# EAGLE design BpodFSM_r2_5_v6 (EAGLE 9.6.2)
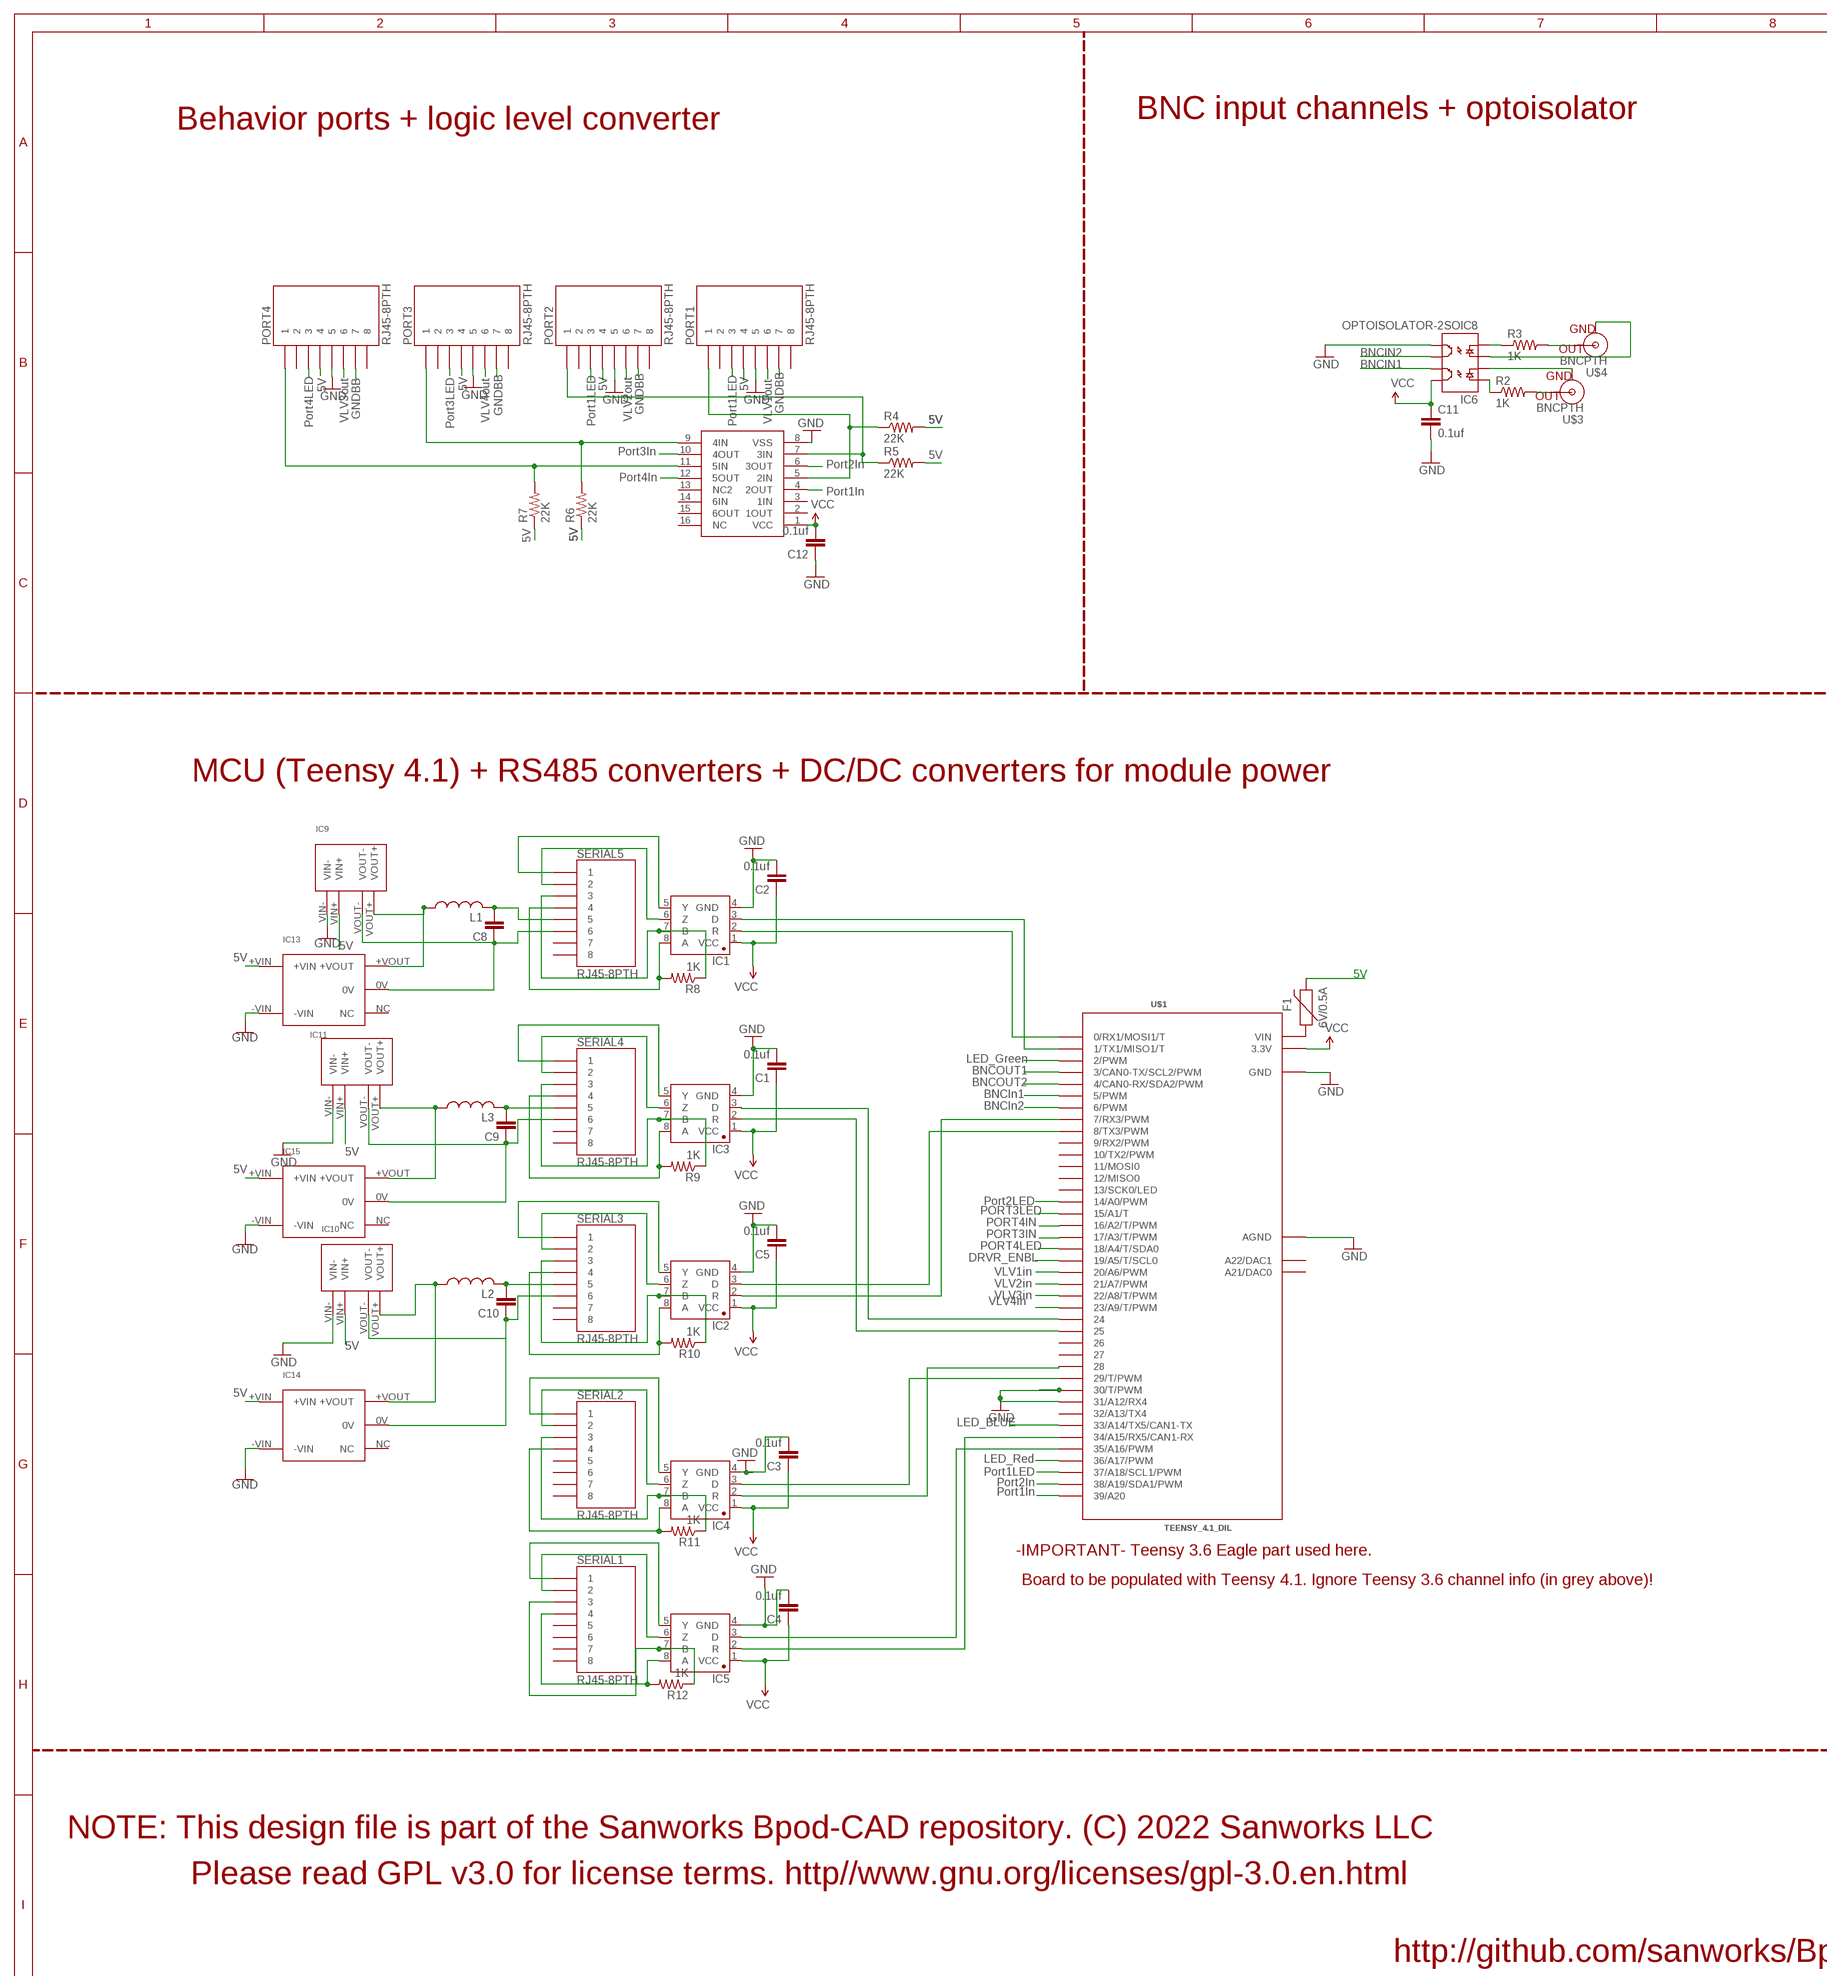
[diagram p0: schematic, sheet 1, part 1 of 2]
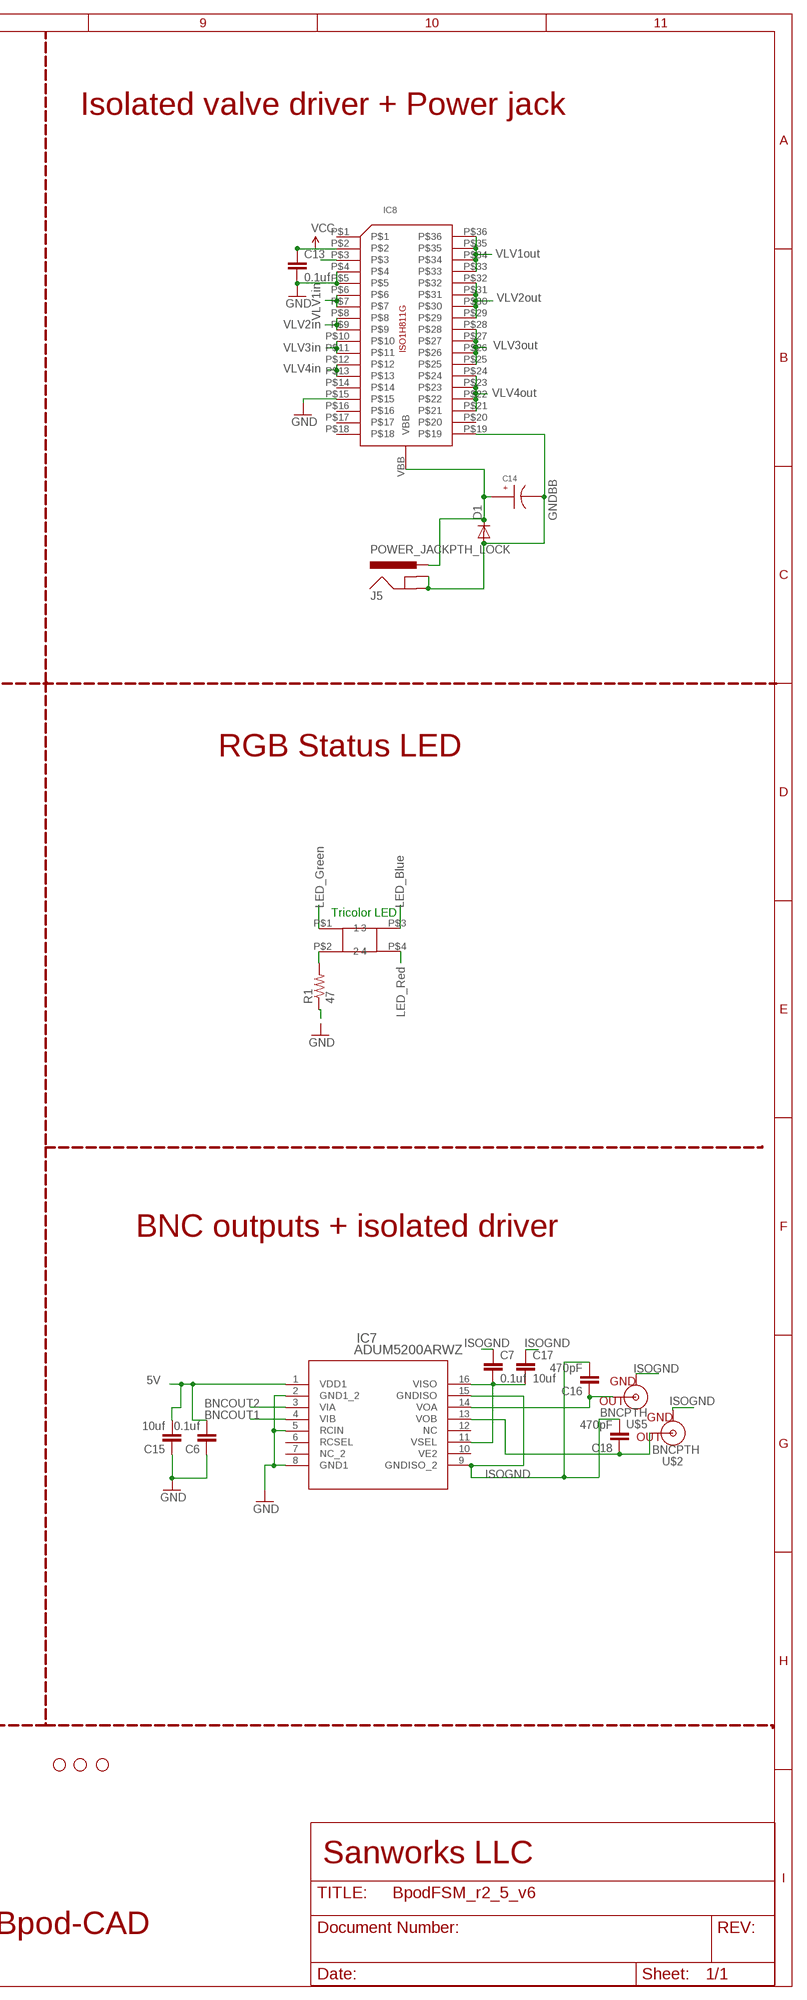
[diagram p1: schematic, sheet 1, part 2 of 2]

## Parts
C1  0.1uf  CAP1206  [1206@1]
C2  0.1uf  CAP1206  [1206@1]
C3  0.1uf  CAP1206  [1206@1]
C4  0.1uf  CAP1206  [1206@1]
C5  0.1uf  CAP1206  [1206@1]
C6  0.1uf  1.0UF-0805-25V-10%  [0805]
C7  0.1uf  1.0UF-0805-25V-10%  [0805]
C8  CAP1206  [1206@1]
C9  CAP1206  [1206@1]
C10  CAP1206  [1206@1]
C11  0.1uf  CAP1206  [1206@1]
C12  0.1uf  CAP1206  [1206@1]
C13  0.1uf  CAP1206  [1206@1]
C14  EEE-FK1H100UR  [EEE-FK1H100UR]
C15  10uf  CAP1206  [1206@1]
C16  470pF  1.0UF-0805-25V-10%  [0805]
C17  10uf  CAP1206  [1206@1]
C18  470pF  1.0UF-0805-25V-10%  [0805]
D1  DIODE-DO214AA  [DO214AA]
F1  6V/0.5A  PPTC_HALF-AMP  [1206]
IC1  SN65HVD31DR  [SO08]
IC2  SN65HVD31DR  [SO08]
IC3  SN65HVD31DR  [SO08]
IC4  SN65HVD31DR  [SO08]
IC5  SN65HVD31DR  [SO08]
IC6  OPTOISOLATOR-2SOIC8  [SO08-2]
IC7  ADUM5200ARWZ  [RW_16]
IC8  ISO1H811G  [ISO1H811G]
IC9  NME0509SC  [NME0509SC]
IC10  NME0509SC  [NME0509SC]
IC11  NME0509SC  [NME0509SC]
IC12  CD4050  [SO16]
IC13  MTU1D0505MC  [MTU1D0505MC]
IC14  MTU1D0505MC  [MTU1D0505MC]
IC15  MTU1D0505MC  [MTU1D0505MC]
J5  POWER_JACKPTH_LOCK  [POWER_JACK_PTH_LOCK]
JP3  STAND-OFF  [STAND-OFF]
JP4  STAND-OFF  [STAND-OFF]
JP5  STAND-OFF  [STAND-OFF]
L1  L-USL3225M  [L3225M]
L2  L-USL3225M  [L3225M]
L3  L-USL3225M  [L3225M]
PORT1  RJ45-8PTH  [RJ45-8]
PORT2  RJ45-8PTH  [RJ45-8]
PORT3  RJ45-8PTH  [RJ45-8]
PORT4  RJ45-8PTH  [RJ45-8]
R1  47  RESISTOR1206  [1206]
R2  1K  RESISTOR1206  [1206]
R3  1K  RESISTOR1206  [1206]
R4  22K  RESISTOR1206  [1206]
R5  22K  RESISTOR1206  [1206]
R6  22K  RESISTOR1206  [1206]
R7  22K  RESISTOR1206  [1206]
R8  1K  RESISTOR1206  [1206]
R9  1K  RESISTOR1206  [1206]
R10  1K  RESISTOR1206  [1206]
R11  1K  RESISTOR1206  [1206]
R12  1K  RESISTOR1206  [1206]
SERIAL1  RJ45-8PTH  [RJ45-8]
SERIAL2  RJ45-8PTH  [RJ45-8]
SERIAL3  RJ45-8PTH  [RJ45-8]
SERIAL4  RJ45-8PTH  [RJ45-8]
SERIAL5  RJ45-8PTH  [RJ45-8]
U$1  TEENSY_4.1_DIL  TEENSY_3.6_DIL  [TEENSY_3.6_DIL]
U$2  BNCPTH  [BNC]
U$3  BNCPTH  [BNC]
U$4  BNCPTH  [BNC]
U$5  BNCPTH  [BNC]
U$8  SQUARE_TRICOLOR_LED  [SQUARE_TRICOLOR_LED]

## Nets
5V: C6.2 C15.2 F1.2 IC7.1(VDD1) IC9.VIN+ IC10.VIN+ IC11.VIN+ IC13.+VIN IC14.+VIN IC15.+VIN PORT1.4 PORT2.4 PORT3.4 PORT4.4 R4.2 R5.2 R6.1 R7.1
BNCIN1: IC6.7(EM1) U$1.6(6/PWM)
BNCIN2: IC6.6(CL2) U$1.5(5/PWM)
BNCOUT1: IC7.4(VIB) U$1.4(4/CAN0-RX/SDA2/PWM)
BNCOUT2: IC7.3(VIA) U$1.3(3/CAN0-TX/SCL2/PWM)
DRVR_ENBL: IC8.P$3 U$1.19/A5(19/A5/T/SCL0)
GND: C1.2 C2.2 C3.2 C4.2 C5.2 C6.1 C11.2 C12.1 C13.2 C15.1 IC1.4(GND) IC2.4(GND) IC3.4(GND) IC4.4(GND) IC5.4(GND) IC6.5(EM2) IC7.2(GND1_2) IC7.5(RCIN) IC7.8(GND1) IC8.P$4 IC8.P$5 IC8.P$15 IC9.VIN- IC10.VIN- IC11.VIN- IC12.8(VSS) IC13.-VIN IC14.-VIN IC15.-VIN PORT1.5 PORT2.5 PORT3.5 PORT4.5 R1.1 U$1.30(30/T/PWM) U$1.31/A12(31/A12/RX4) U$1.AGND U$1.GND U$1.GND1(GND)
GNDBB: C14.CATHODE D1.A IC8.P$19 J5.GND J5.GNDBREAK PORT1.7 PORT2.7 PORT3.7 PORT4.7
ISOGND: C7.1 C16.2 C17.1 C18.2 IC7.9(GNDISO_2) IC7.15(GNDISO) U$2.GND U$5.GND
LED_BLUE: U$1.33/A14(33/A14/TX5/CAN1-TX) U$8.P$3
LED_GREEN: U$1.2(2/PWM) U$8.P$1
LED_RED: U$1.36/A17(36/A17/PWM) U$8.P$4
N$1: IC3.8(A) R9.2 SERIAL4.4
N$2: IC3.7(B) R9.1 SERIAL4.3
N$3: IC3.6(Z) SERIAL4.2
N$4: IC3.5(Y) SERIAL4.1
N$5: IC3.2(R) U$1.25
N$6: IC3.3(D) U$1.24
N$7: IC1.8(A) R8.2 SERIAL5.4
N$8: IC1.7(B) R8.1 SERIAL5.3
N$9: IC1.6(Z) SERIAL5.2
N$10: IC1.5(Y) SERIAL5.1
N$11: IC1.2(R) U$1.0(0/RX1/MOSI1/T)
N$12: IC1.3(D) U$1.1(1/TX1/MISO1/T)
N$13: IC6.3(A2) U$4.GND
N$14: R3.2 U$4.S(OUT)
N$15: R2.2 U$3.S(OUT)
N$16: IC6.2(C1) U$3.GND
N$17: IC2.8(A) R10.2 SERIAL3.4
N$18: IC2.7(B) R10.1 SERIAL3.3
N$19: IC2.6(Z) SERIAL3.2
N$20: IC12.7(3IN) PORT2.1 R5.1
N$21: IC2.5(Y) SERIAL3.1
N$22: IC2.2(R) U$1.7(7/RX3/PWM)
N$23: C8.2 L1.2 SERIAL5.5
N$24: IC12.9(4IN) PORT3.1 R6.2
N$25: R1.2 U$8.P$2
N$26: C8.1 IC9.VOUT- IC13.0V SERIAL5.6
N$27: C18.1 IC7.13(VOB) U$2.S(OUT)
N$28: IC2.3(D) U$1.8(8/TX3/PWM)
N$29: F1.1 U$1.VIN
N$30: IC4.2(R) U$1.28
N$31: IC12.11(5IN) PORT4.1 R7.2
N$32: IC5.8(A) R12.2 SERIAL1.4
N$33: IC5.7(B) R12.1 SERIAL1.3
N$34: IC5.6(Z) SERIAL1.2
N$35: IC5.5(Y) SERIAL1.1
N$36: IC4.8(A) R11.2 SERIAL2.4
N$37: IC4.7(B) R11.1 SERIAL2.3
N$38: IC4.6(Z) SERIAL2.2
N$39: IC9.VOUT+ IC13.+VOUT L1.1
N$40: IC4.5(Y) SERIAL2.1
N$41: IC11.VOUT+ IC15.+VOUT L3.1
N$42: IC5.2(R) U$1.34/A15(34/A15/RX5/CAN1-RX)
N$43: C10.1 IC10.VOUT- IC14.0V SERIAL3.6
N$44: C10.2 L2.2 SERIAL3.5
N$45: IC10.VOUT+ IC14.+VOUT L2.1
N$46: C7.2 C17.2 IC7.11(VSEL) IC7.16(VISO)
N$47: C9.1 IC11.VOUT- IC15.0V SERIAL4.6
N$48: IC5.3(D) U$1.35/A16(35/A16/PWM)
N$49: C9.2 L3.2 SERIAL4.5
N$50: C16.1 IC7.14(VOA) U$5.S(OUT)
N$51: IC4.3(D) U$1.29(29/T/PWM)
N$54: IC6.1(A1) R2.1
N$55: IC6.4(C2) R3.1
N$56: IC12.5(2IN) PORT1.1 R4.1
PORT1IN: IC12.4(2OUT) U$1.39/A20
PORT1LED: PORT1.3 U$1.37/A18(37/A18/SCL1/PWM)
PORT2IN: IC12.6(3OUT) U$1.38/A19(38/A19/SDA1/PWM)
PORT2LED: PORT2.3 U$1.14/A0(14/A0/PWM)
PORT3IN: IC12.10(4OUT) U$1.17/A3(17/A3/T/PWM)
PORT3LED: PORT3.3 U$1.15/A1(15/A1/T)
PORT4IN: IC12.12(5OUT) U$1.16/A2(16/A2/T/PWM)
PORT4LED: PORT4.3 U$1.18/A4(18/A4/T/SDA0)
VBB: C14.ANODE D1.C IC8.VBB J5.PWR
VCC: C1.1 C2.1 C3.1 C4.1 C5.1 C11.1 C12.2 C13.1 IC1.1(VCC) IC2.1(VCC) IC3.1(VCC) IC4.1(VCC) IC5.1(VCC) IC6.8(CL1) IC8.P$2 IC12.1(VCC) U$1.3.3V U$1.3.3V3(3.3V)
VLV1IN: IC8.P$6 IC8.P$7 U$1.23/A9(23/A9/T/PWM)
VLV1OUT: IC8.P$33 IC8.P$34 IC8.P$35 IC8.P$36 PORT1.6
VLV2IN: IC8.P$8 IC8.P$9 U$1.22/A8(22/A8/T/PWM)
VLV2OUT: IC8.P$29 IC8.P$30 IC8.P$31 IC8.P$32 PORT2.6
VLV3IN: IC8.P$12 IC8.P$13 U$1.20/A6(20/A6/PWM)
VLV3OUT: IC8.P$21 IC8.P$22 IC8.P$23 IC8.P$24 PORT3.6
VLV4IN: IC8.P$10 IC8.P$11 U$1.21/A7(21/A7/PWM)
VLV4OUT: IC8.P$25 IC8.P$26 IC8.P$27 IC8.P$28 PORT4.6
Unconnected: IC7.6(RCSEL) IC7.7(NC_2) IC7.10(VE2) IC7.12(NC) IC8.P$1 IC8.P$14 IC8.P$16 IC8.P$17 IC8.P$18 IC8.P$20 IC12.2(1OUT) IC12.3(1IN) IC12.13(NC2) IC12.14(6IN) IC12.15(6OUT) IC12.16(NC) IC13.NC IC14.NC IC15.NC PORT1.2 PORT1.8 PORT2.2 PORT2.8 PORT3.2 PORT3.8 PORT4.2 PORT4.8 SERIAL1.5 SERIAL1.6 SERIAL1.7 SERIAL1.8 SERIAL2.5 SERIAL2.6 SERIAL2.7 SERIAL2.8 SERIAL3.7 SERIAL3.8 SERIAL4.7 SERIAL4.8 SERIAL5.7 SERIAL5.8 U$1.9(9/RX2/PWM) U$1.10(10/TX2/PWM) U$1.11(11/MOSI0) U$1.12(12/MISO0) U$1.13(13/SCK0/LED) U$1.26 U$1.27 U$1.32/A13(32/A13/TX4) U$1.A21(A21/DAC0) U$1.A22(A22/DAC1)

## Notes on the sheet
- BNC input channels + optoisolator | Isolated valve driver + Power jack
- Behavior ports + logic level converter
- VLV1out
- VLV2out
- VLV1in
- VLV2in
- BNCIN2 | VLV3in | VLV3out
- BNCIN1
- VLV4in
- 5V | 5V | 5V | 5V
- VLV4out
- GNDBB | GNDBB | GNDBB
- GNDBB | VLV2out
- VLV3out | VLV4out | VLV1out | 5V
- Port4LED | Port3LED | Port1LED | Port1LED
- Port3In
- 5V
- Port2In
- Port4In
- GNDBB
- Port1In
- 5V | 5V
- RGB Status LED
- MCU (Teensy 4.1) + RS485 converters + DC/DC converters for module power
- LED_Green
- LED_Blue
- Tricolor LED
- 5V | LED_Red
- LED_Green
- BNCOUT1
- BNCOUT2
- BNCIn1
- BNCIn2
- Port2LED
- BNC outputs + isolated driver
- DRVR_ENBL
- VLV1in
- VLV2in
- VLV3in
- VLV4in
- LED_Red
- Port1LED
- Port2In
- Port1In
- -IMPORTANT- Teensy 3.6 Eagle part used here.
- Board to be populated with Teensy 4.1. Ignore Teensy 3.6 channel info (in grey above)!
- NOTE: This design file is part of the Sanworks Bpod-CAD repository. (C) 2022 Sanworks LLC
- Please read GPL v3.0 for license terms. http//www.gnu.org/licenses/gpl-3.0.en.html | Sanworks LLC
- http://github.com/sanworks/Bpod-CAD

## Library data of the parts
C1-C5 C8-C13 C15 C17 = SparkFun-Capacitors:CAP: Capacitor Standard 0603 ceramic capacitor, and 0.1" leaded capacitor.
C6 C7 C16 C18 = SparkFun-Capacitors:1.0UF: 1µF ceramic capacitors A capacitor is a passive two-terminal electrical component used to store electrical energy temporarily in an electric field.; PROD_ID: CAP-08064; VALUE: 1.0uF
C14 = JoshParts10:EEE-FK1H100UR
D1 = diode:DIODE-: DIODE
F1 = SparkFun-Fuses:PPTC: Resettable Fuse PPTC Resettable Fuse. Really a sort of resistor with a polymeric positive temperature coefficient whose resistance increases dramatically with an increase in temperature. When heated by the power passing through the resistance rises causing the current to be limited, protecting the circuit. This is achieved by the transition of the polymer from a crystalline to an amorphous state where the conductive carbon separates breaking the conductive pathways found in the cool crystalline structure. When a PPTC cools back down it resumes conducting letting the circuit turn back on. SparkFun Products: SparkFun RedBoard - Programmed with Arduino <https://www.sparkfun.com/products/12757> Pro Micro - 5V/16MHz <https://www.sparkfun.com/products/12640> Arduino Pro 328 - 5V/16MHz <https://www.sparkfun.com/products/10915> MP3 Trigger <https://www.sparkfun.com/products/13720>; PROD_ID: RES-08585
IC1-IC5 = Joshparts4:SN65HVD31DR: A placeholder for generic narrow & wide SOIC8 foorptints - used on the DIP adapter board.
IC6 = SparkFun-DiscreteSemi:OPTOISOLATOR-2: Description: Dual gate opto isolator. Vishay part : ILD213T; PROD_ID: IC-09076
IC7 = ADUM5200:ADUM5200ARWZ
IC8 = JoshParts10:ISO1H811G
IC9-IC11 = JoshParts10:NME0509SC
IC12 = SparkFun-DigitalIC:CD4050
IC13-IC15 = JoshParts10:MTU1D0505MC
J5 = SparkFun-Connectors:POWER_JACK: Power Jack Connector This is the standard 5.5mm barrel jack for power. The PTH is the most common, proven, reliable, footprint. The Slot footprint only works if the mill layer is transmitted to the PCB fab house so be warned. Here are the connectors we sell at SparkFun: DC Barrel Power Jack/Connector <https://www.sparkfun.com/products/119> (PRT-00119) DC Barrel Power Jack/Connector (SMD) <https://www.sparkfun.com/products/12748> (PRT-12748) DC Barrel Jack Adapter - Breadboard Compatible <https://www.sparkfun.com/products/10811> (PRT-10811) It is used on this SparkFun product (and many, many others): SparkFun RedBoard - Programmed with Arduino <https://www.sparkfun.com/products/12757> (DEV-12757) Also, if you need a mating power supply or connector, please check these out: Wall Adapter Power Supply - 9VDC 650mA <https://www.sparkfun.com/products/298> (TOL-00298) DC Barrel Jack Adapter - Male <https://www.sparkfun.com/products/10287> (PRT-10287); PROD_ID: CONN-08197; SF_ID: PRT-00119
JP3-JP5 = SparkFun:STAND-OFF: Stand Off This is the mechanical footprint for a #4 phillips button head screw. Use the keepout ring to avoid running the screw head into surrounding components. SKU : PRT-00447
L1-L3 = rcl:L-US: INDUCTOR, American symbol
PORT1-PORT4 SERIAL1-SERIAL5 = SparkFun:RJ45-8: RJ45 Jack Simple RJ45, 8-pin connection - connector for common Cat5, Cat5e, and Cat6 Ethernet cables. Footprint not yet proven in production. Connector sku is PRT-00643; Breakout PCB sku is BOB-00716.
R1 = SparkFun-Passives:RESISTOR: Resistor Basic schematic elements and footprints for 0603, 1206, and PTH resistors.
R2-R12 = SparkFun-Resistors:RESISTOR: Resistor Basic schematic elements and footprints for 0603, 1206, and PTH resistors.
U$1 = Teensy_3_and_LC_Series_Boards_v1.4:TEENSY_3.6_DIL: Teensy 3.6 DIL Package
U$2-U$5 = SparkFun-Connectors:BNC: BNC Right Angle Connector Mouser Part# 5227161 SparkFun Products: BNC Connector - Right Angle <https://www.sparkfun.com/products/10550>; PROD_ID: LPA-12729; SF_ID: PRT-10550
U$8 = JoshParts:SQUARE_TRICOLOR_LED

## Net classes
0 default: width 0.254 mm, clearance 0.254 mm

## Board
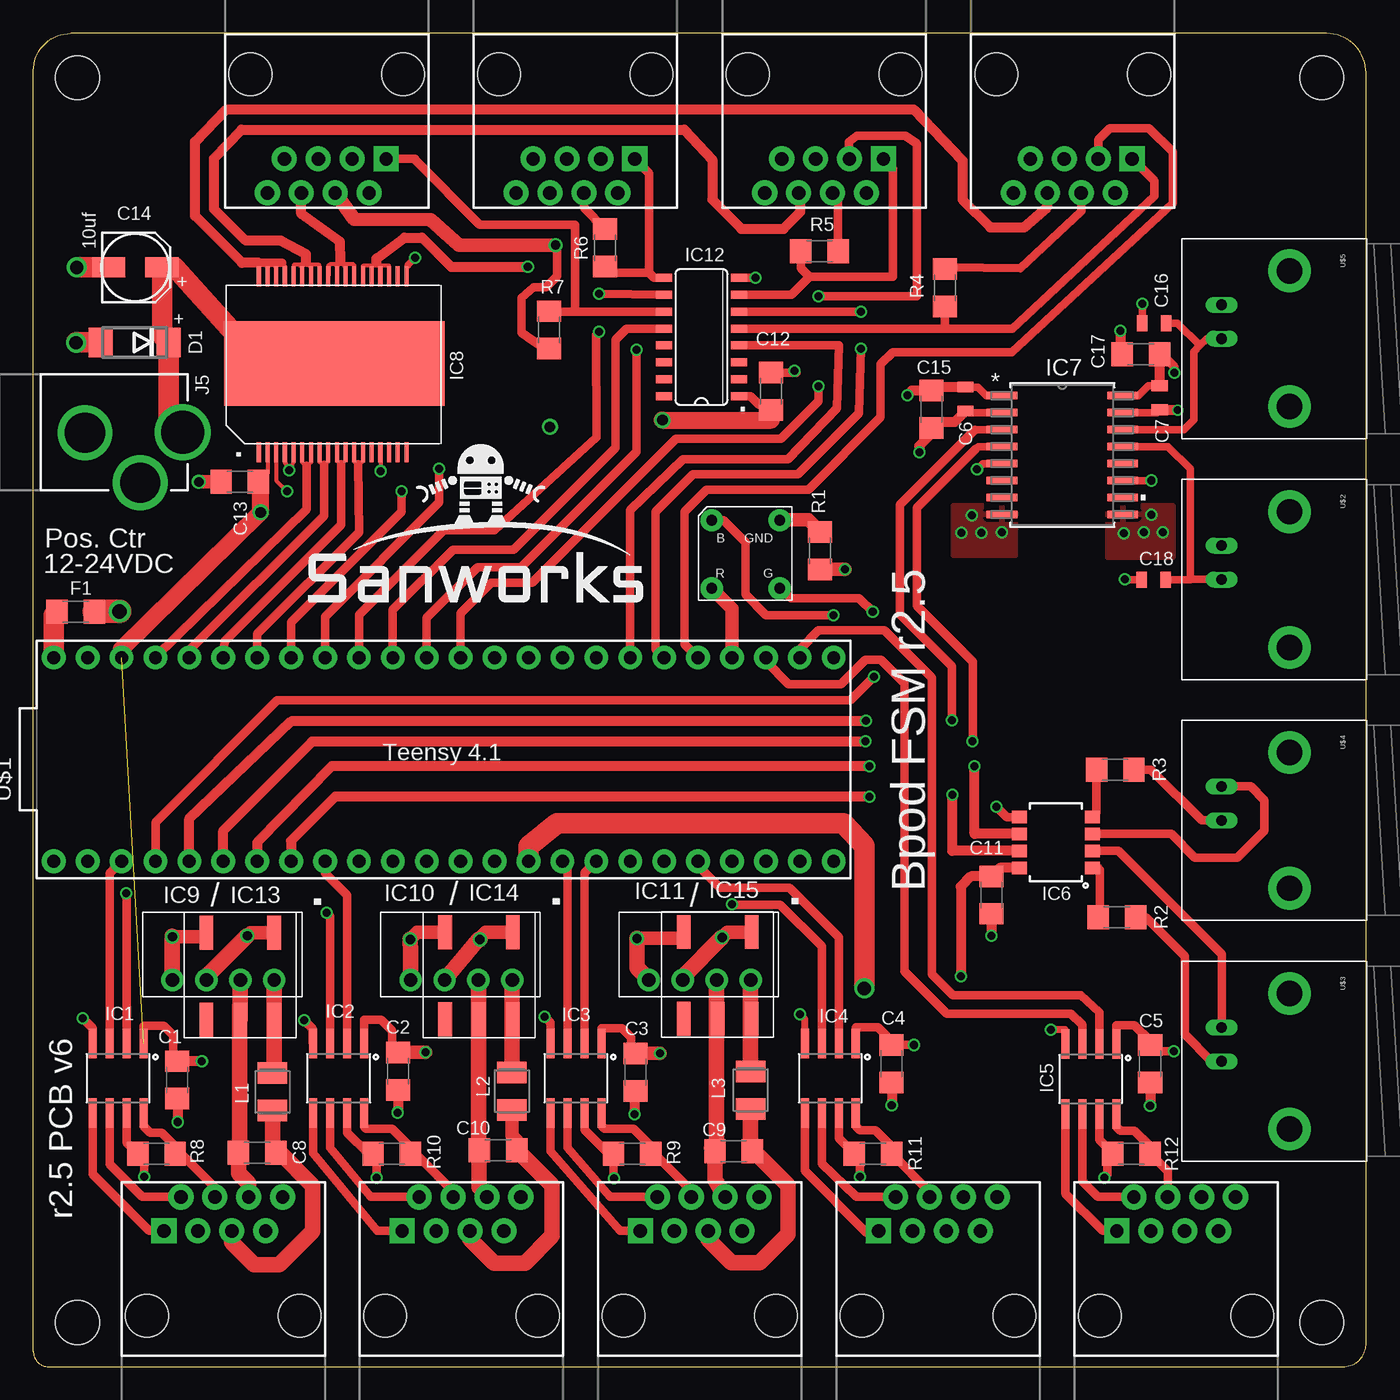
[diagram p2: board, top side]
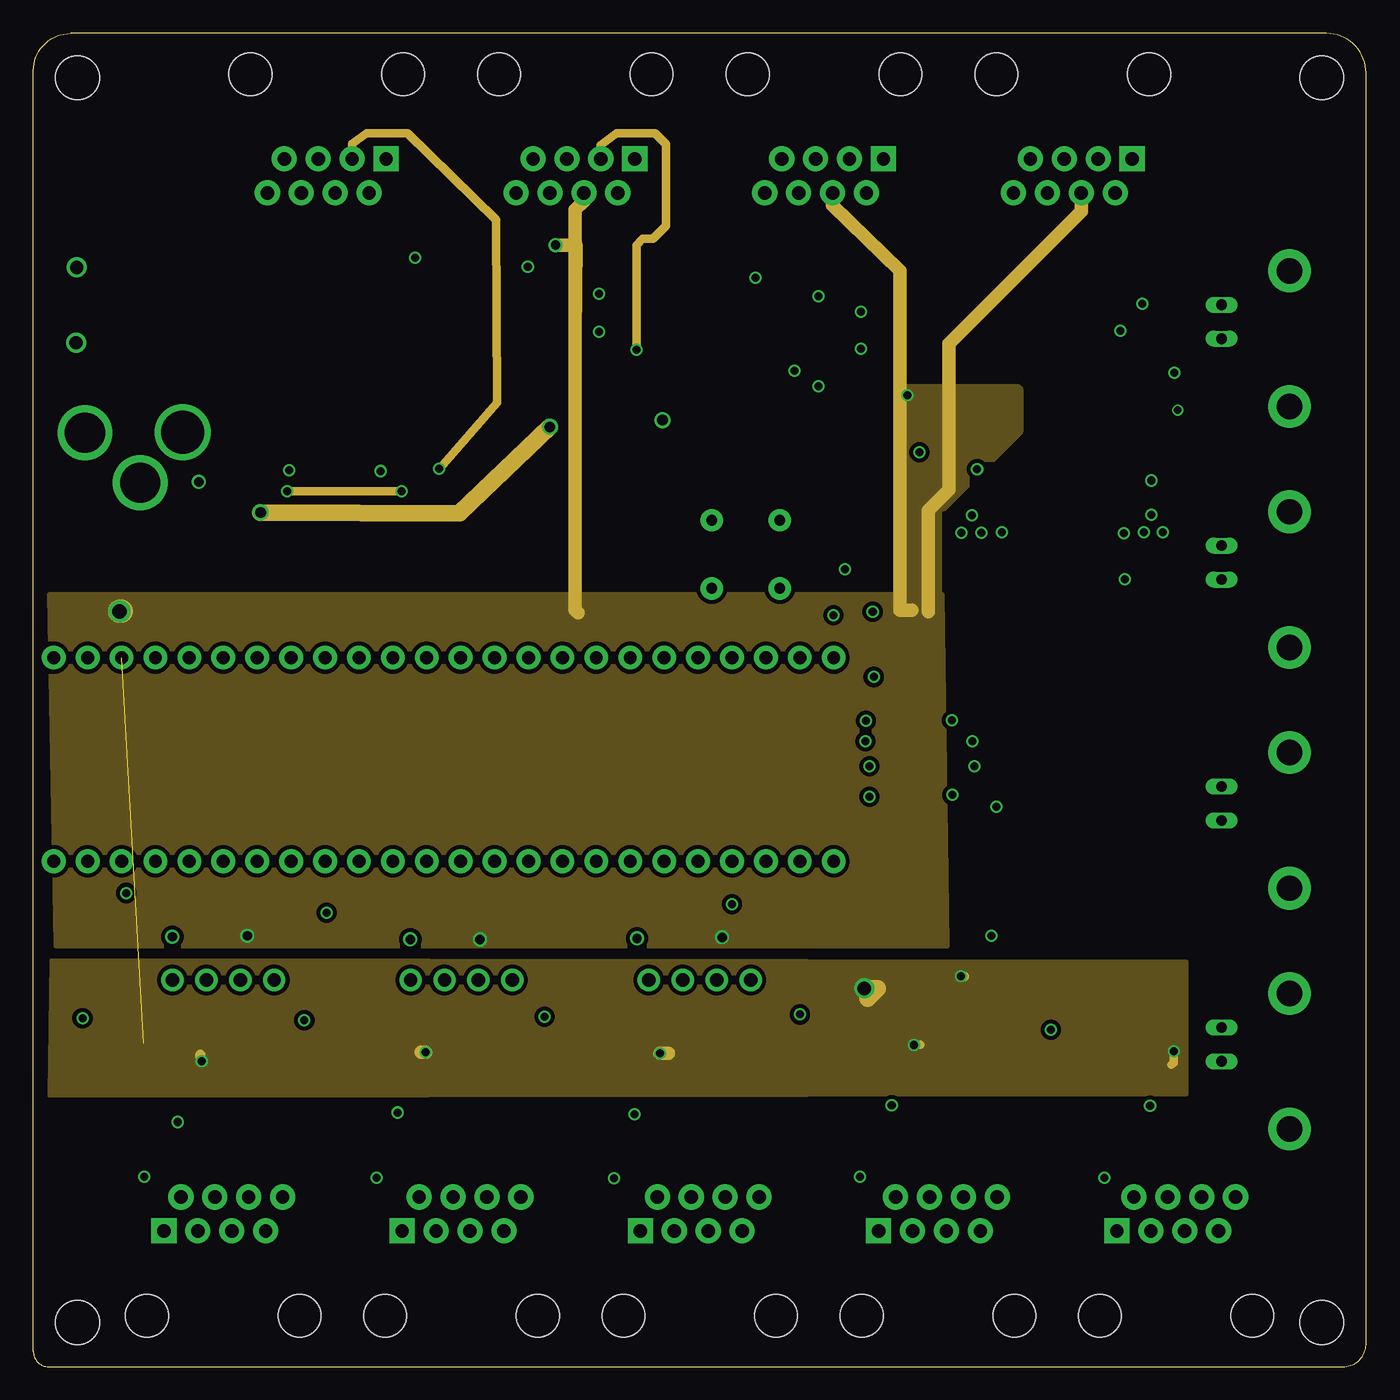
[diagram p3: board, inner layer Route2]
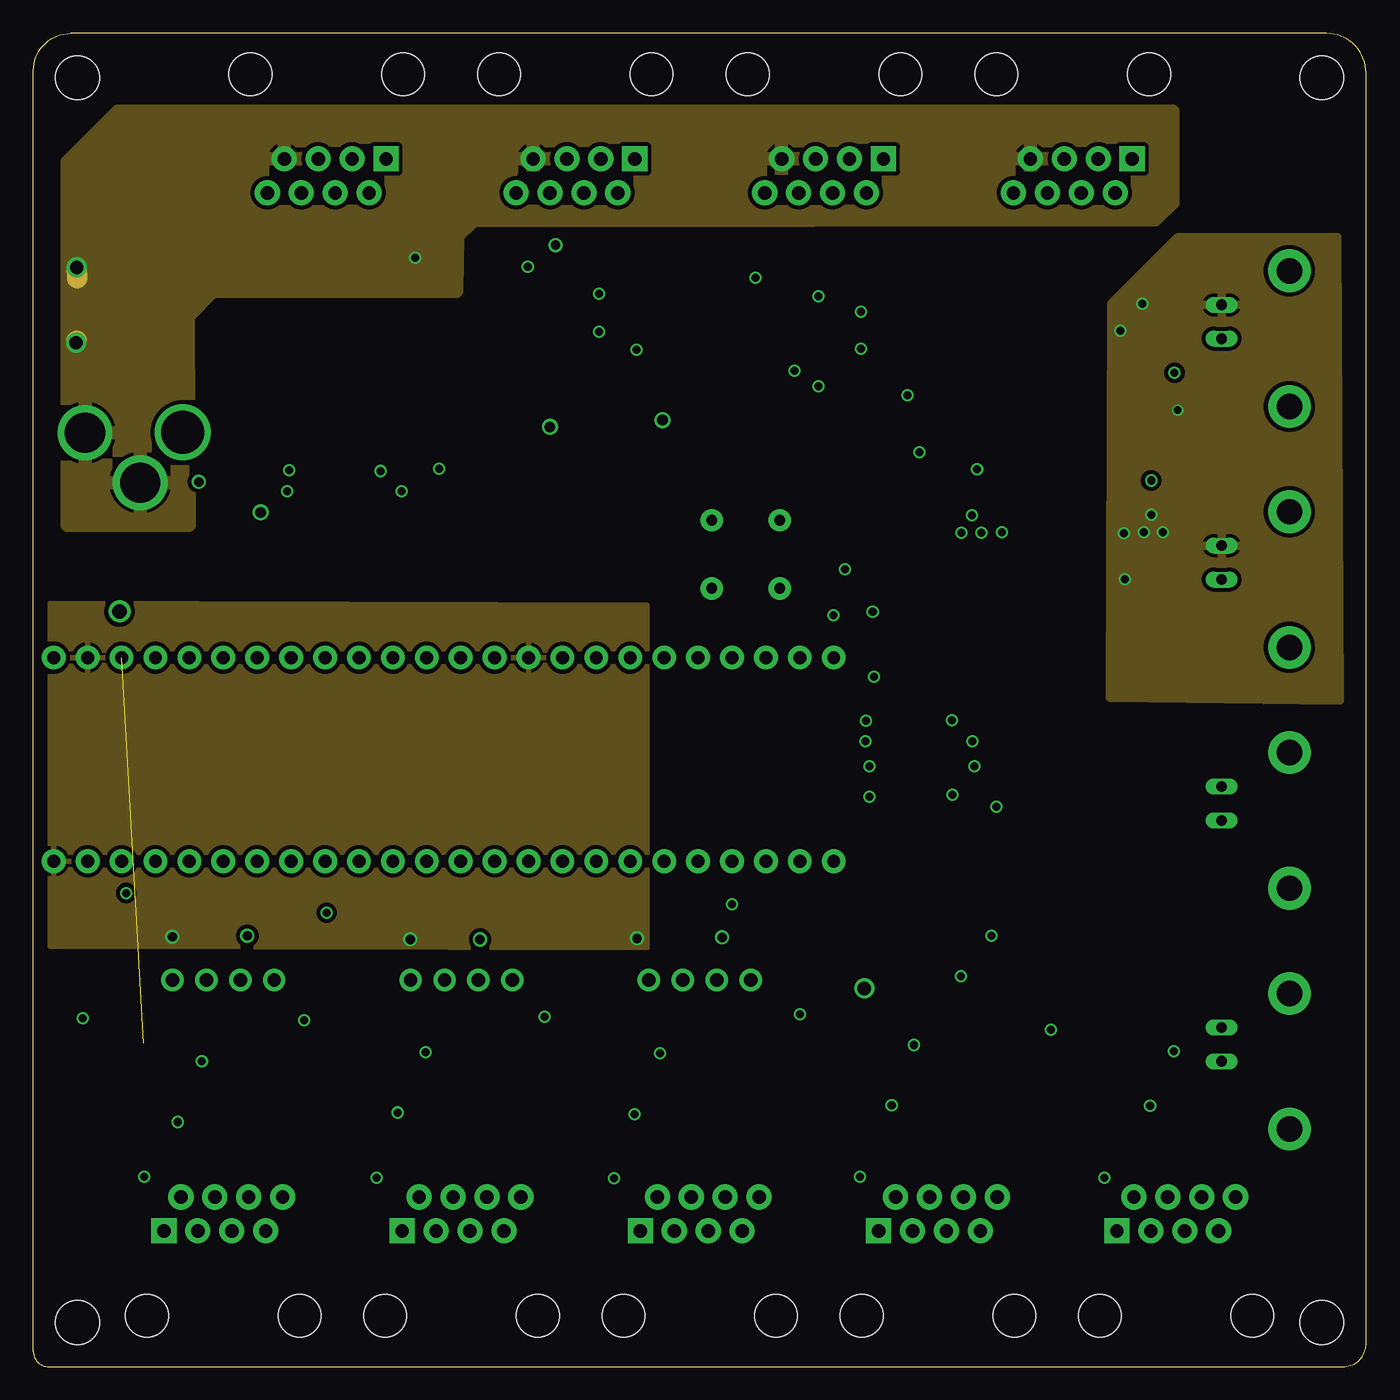
[diagram p4: board, inner layer Route15]
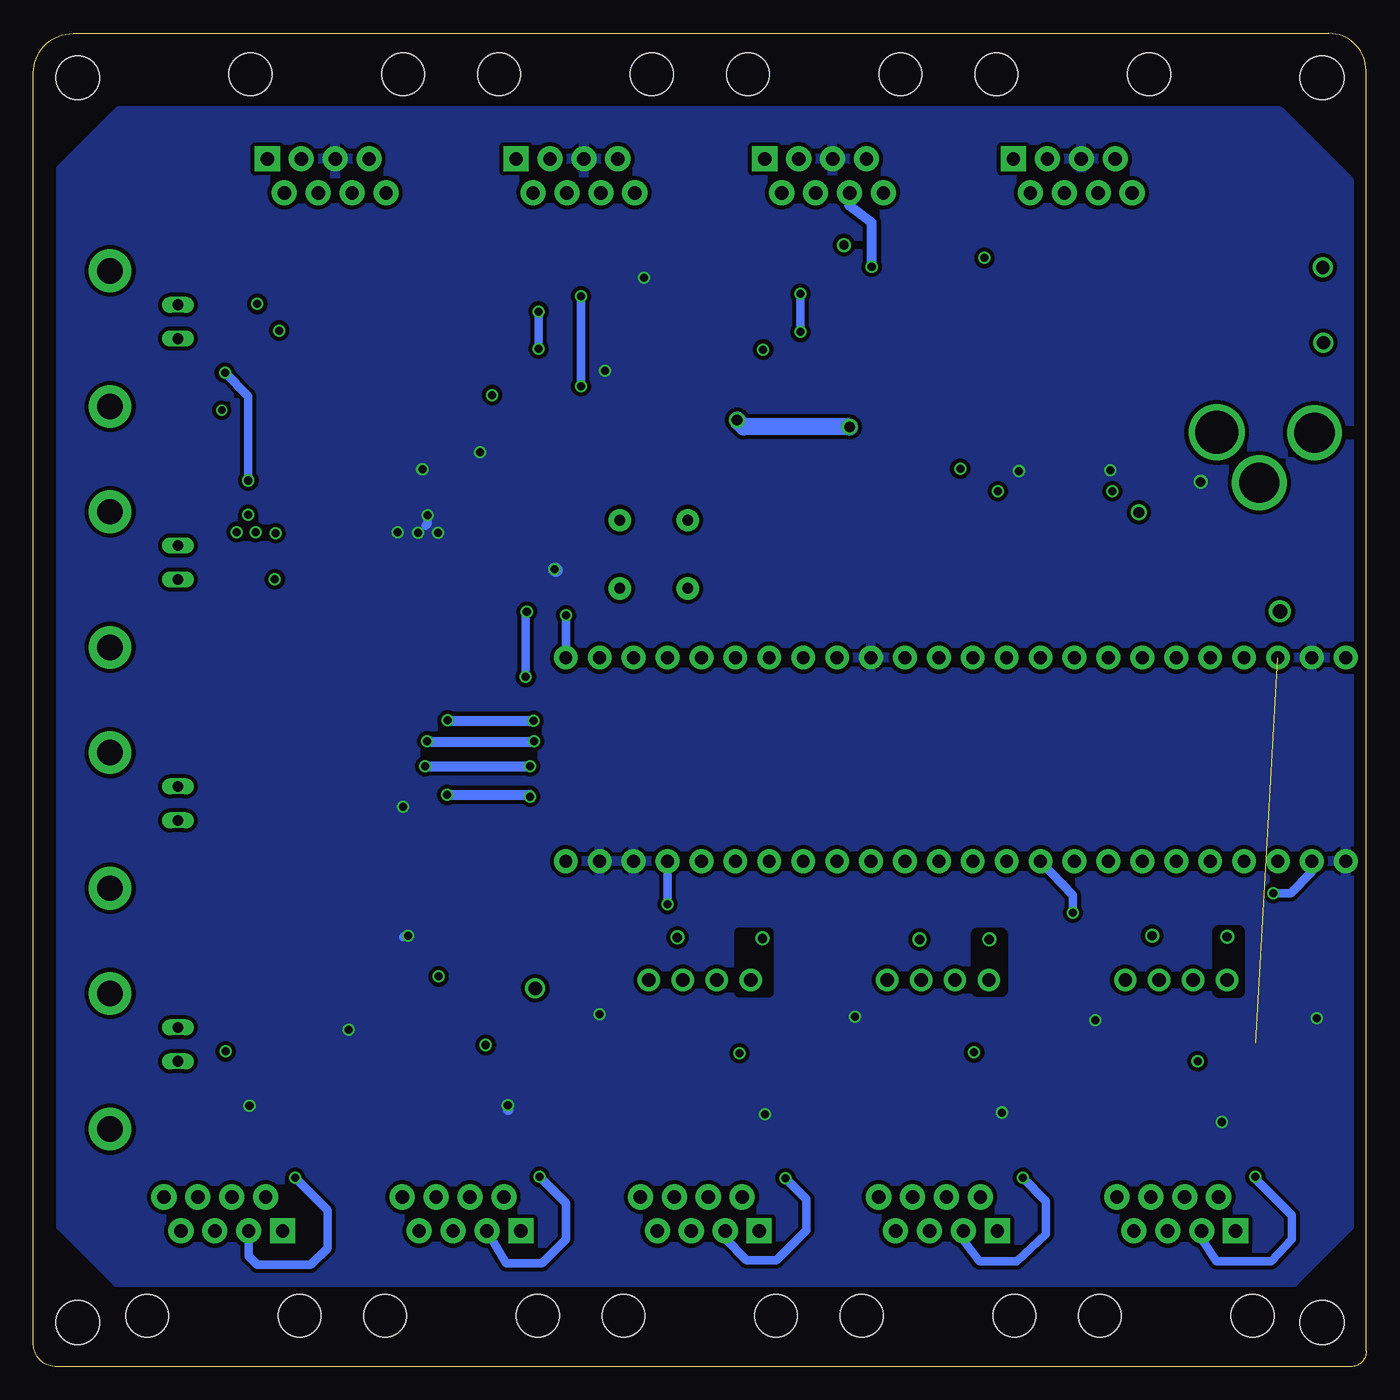
[diagram p5: board, bottom side, seen from below]

Size 99.82 x 99.82 mm. Coordinates in mm from the lower left corner, seen from the top.
Outline: 0,1.14 0,97.04 arc-90 2.79,99.82 96.86,99.82 arc-90 99.82,96.86 99.82,1.79 arc-90 98.21,0 1.14,0 arc-90 0,1.14
Copper layers (1*2*15*16): Top 0.035mm / dielectric 0.2mm / Route2 0.0175mm / dielectric 0.3mm / Route15 0.0175mm / dielectric 0.2mm / Bottom 0.035mm
Design rules "SeeedStudio_4layer_DRU_no_angle_20140221 *": minimum track width 8mil, minimum drill 12mil, track to track 12mil, track to pad 12mil, pad to pad 12mil, via to via 12mil, smd to smd 0mil, copper to edge 10mil, drill to drill 8mil, minimum pad ring 6mil, minimum via ring 4mil, stop-mask expansion 4mil, vias tented up to drill 25mil, thermal gap 10mil
bRestrict: area 27.3,28.2 to 29.1,32.4; area 44.7,27.9 to 47,32.6; area 9.6,28.1 to 11,32.6; 8 lines

### Footprints (pad centres in the part's own frame; a part is rotated, then mirrored left to right if it is on the bottom)
1206@1 = smd 1.6 x 1.8: 1 -1.4,0; 2 1.4,0
0805 = smd 0.8 x 1.2: 1 -0.9,0; 2 0.9,0
EEE-FK1H100UR = smd 1.5 x 2.5: ANODE 0,4; CATHODE 0,0
DO214AA = smd 1.8 x 2.2: A 2.55,0; C -2.55,0
1206 = smd 1.6 x 1.8: 1 -1.4,0; 2 1.4,0
SO08 = smd 0.61 x 2.21: 1 -1.905,-2.616; 2 -0.635,-2.616; 3 0.635,-2.616; 4 1.905,-2.616; 5 1.905,2.616; 6 0.635,2.616; 7 -0.635,2.616; 8 -1.905,2.616
SO08-2 = smd 0.914 x 1.143: 1 -1.905,-2.731; 2 -0.635,-2.731; 3 0.635,-2.731; 4 1.905,-2.731; 5 1.905,2.731; 6 0.635,2.731; 7 -0.635,2.731; 8 -1.905,2.731
RW_16 = smd 2.299 x 0.559: 1 -4.528,4.445; 2 -4.528,3.175; 3 -4.528,1.905; 4 -4.528,0.635; 5 -4.528,-0.635; 6 -4.528,-1.905; 7 -4.528,-3.175; 8 -4.528,-4.445; 9 4.528,-4.445; 10 4.528,-3.175; 11 4.528,-1.905; 12 4.528,-0.635; 13 4.528,0.635; 14 4.528,1.905; 15 4.528,3.175; 16 4.528,4.445
ISO1H811G = smd 1.5 x 0.305: P$1 0,11.05; P$2 0,10.4; P$3 0,9.75; P$4 0,9.1; P$5 0,8.45; P$6 0,7.8; P$7 0,7.15; P$8 0,6.5; P$9 0,5.85; P$10 0,5.2; P$11 0,4.55; P$12 0,3.9; P$13 0,3.25; P$14 0,2.6; P$15 0,1.95; P$16 0,1.3; P$17 0,0.65; P$18 0,0; P$19 13.2,0; P$20 13.2,0.65; P$21 13.2,1.3; P$22 13.2,1.95; P$23 13.2,2.6; P$24 13.2,3.25; P$25 13.2,3.9; P$26 13.2,4.55; P$27 13.2,5.2; P$28 13.2,5.85; P$29 13.2,6.5; P$30 13.2,7.15; P$31 13.2,7.8; P$32 13.2,8.45; P$33 13.2,9.1; P$34 13.2,9.75; P$35 13.2,10.4; P$36 13.2,11.05 | smd 6.3 x 16.51: VBB 6.65,5.4
NME0509SC = drill 1 pad 1.676: VIN+ -1.27,-2.032; VIN- -3.81,-2.032; VOUT+ 3.81,-2.032; VOUT- 1.27,-2.032
SO16 = smd 0.6 x 1.2: 1 -4.445,-2.8; 2 -3.175,-2.8; 3 -1.905,-2.8; 4 -0.635,-2.8; 5 0.635,-2.8; 6 1.905,-2.8; 7 3.175,-2.8; 8 4.445,-2.8; 9 4.445,2.8; 10 3.175,2.8; 11 1.905,2.8; 12 0.635,2.8; 13 -0.635,2.8; 14 -1.905,2.8; 15 -3.175,2.8; 16 -4.445,2.8
MTU1D0505MC = smd 2.54 x 1.016: 0V 6.502,0; +VIN 0,2.54; +VOUT 6.502,2.54; -VIN 0,-2.54; NC 6.502,-2.54
POWER_JACK_PTH_LOCK = drill 2.997 pad 4.115: GND 0.025,6.557; GNDBREAK 3.762,10.7 | drill 3.2 pad 4.115: PWR 0,13.878
STAND-OFF = hole 3.302: 0,0
L3225M = smd 1.6 x 2.2: 1 -1.4,0; 2 1.4,0
RJ45-8 = drill 1 pad 1.88 square: 1 -4.445,6.35 | drill 1 pad 1.88: 2 -3.175,8.89; 3 -1.905,6.35; 4 -0.635,8.89; 5 0.635,6.35; 6 1.905,8.89; 7 3.175,6.35; 8 4.445,8.89 | hole 3.2: -5.715,0; 5.715,0
TEENSY_3.6_DIL = drill 0.965 pad 1.778: 0 -7.62,25.4; 1 -7.62,22.86; 2 -7.62,20.32; 3 -7.62,17.78; 3.3V 7.62,22.86; 3.3V3 -7.62,-7.62; 4 -7.62,15.24; 5 -7.62,12.7; 6 -7.62,10.16; 7 -7.62,7.62; 8 -7.62,5.08; 9 -7.62,2.54; 10 -7.62,0; 11 -7.62,-2.54; 12 -7.62,-5.08; 13 7.62,-5.08; 14/A0 7.62,-2.54; 15/A1 7.62,0; 16/A2 7.62,2.54; 17/A3 7.62,5.08; 18/A4 7.62,7.62; 19/A5 7.62,10.16; 20/A6 7.62,12.7; 21/A7 7.62,15.24; 22/A8 7.62,17.78; 23/A9 7.62,20.32; 24 -7.62,-10.16; 25 -7.62,-12.7; 26 -7.62,-15.24; 27 -7.62,-17.78; 28 -7.62,-20.32; 29 -7.62,-22.86; 30 -7.62,-25.4; 31/A12 -7.62,-27.94; 32/A13 -7.62,-30.48; 33/A14 7.62,-30.48; 34/A15 7.62,-27.94; 35/A16 7.62,-25.4; 36/A17 7.62,-22.86; 37/A18 7.62,-20.32; 38/A19 7.62,-17.78; 39/A20 7.62,-15.24; A21 7.62,-12.7; A22 7.62,-10.16; AGND 7.62,25.4; GND -7.62,27.94; GND1 7.62,-7.62; VIN 7.62,27.94
BNC = drill 1.9 pad 3.2: 3 -5.08,5.08; 4 5.08,5.08 | drill 0.8 long: GND -2.54,0; S 0,0
SQUARE_TRICOLOR_LED = drill 0.8 pad 1.676: P$1 -5.1,5.1; P$2 -5.1,0; P$3 0,0; P$4 0,5.1

### Placement (x,y rotation side)
C1  10.77,21.46 270 top
C2  27.3,22.12 270 top
C3  45.09,22.05 270 top
C4  64.26,22.68 270 top
C5  83.64,22.68 270 top
C6  69.82,72.44 90 top
C7  84.35,72.54 90 top
C8  16.76,16 0 top
C9  52.45,16.13 0 top
C10  34.8,16.21 0 top
C11  71.75,35.31 270 top
C12  55.24,73.03 270 top
C13  15.47,66.27 180 top
C14  5.64,82.3 270 top
C15  67.26,71.68 90 top
C16  83.95,78.13 180 top
C17  82.96,75.79 0 top
C18  83.9,58.93 180 top
D1  7.59,76.68 180 top
F1  3.17,56.52 0 top
IC1  6.35,21.59 180 top
IC2  22.86,21.59 180 top
IC3  40.64,21.59 180 top
IC4  59.69,21.59 180 top
IC5  79.2,21.54 180 top
IC6  76.58,39.24 90 top
IC7  77.06,68.25 0 top
IC8  27.94,68.45 90 top
IC9  14.22,30.99 0 top
IC10  32.07,30.99 0 top
IC11  49.91,30.99 0 top
IC12  50.04,77.09 90 top
IC13  15.49,32.49 270 top
IC14  33.38,32.51 270 top
IC15  51.26,32.54 270 top
J5  -2.69,69.95 270 top
JP1  STAND-OFF  [STAND-OFF]  3.3,3.3 0 top
JP3  3.3,96.5 0 top
JP4  96.5,96.5 0 top
JP5  96.5,3.3 0 top
L1  17.91,20.57 270 top
L2  35.84,20.62 270 top
L3  53.72,20.7 270 top
PORT1  77.85,96.77 180 top
PORT2  59.22,96.77 180 top
PORT3  40.6,96.77 180 top
PORT4  21.97,96.77 180 top
R1  58.93,61.09 90 top
R2  81.15,33.66 0 top
R3  81.03,44.7 0 top
R4  68.28,80.77 90 top
R5  58.88,83.52 0 top
R6  42.82,83.77 270 top
R7  38.61,77.62 90 top
R8  9.22,15.93 0 top
R9  44.86,15.93 0 top
R10  26.85,15.93 0 top
R11  62.89,15.93 0 top
R12  82.25,15.93 0 top
SERIAL1  85.6,3.81 0 top
SERIAL2  67.75,3.81 0 top
SERIAL3  32.07,3.81 0 top
SERIAL4  49.91,3.81 0 top
SERIAL5  14.22,3.81 0 top
U$1  29.46,45.47 90 top
U$2  89,58.93 270 top
U$3  89,22.86 270 top
U$4  89,40.89 270 top
U$5  89,76.96 270 top
U$6  [SANWORKS_LOGO]  20.32,57.02 0 top
U$8  50.8,63.37 180 top

### Tracks (layer width: path | path; a pad name or v marks a point on that pad's centre or on a via)
5V  (via drill 0.6, 0.7, 1.1)
  Top 0.559: IC7.1 71.37,72.69 70.73,73.34 C6.2 | 67.51,73.33 C15.2
  Top 0.635: R6.1 41.23,86.76 PORT3.4 | R7.1 38.28,76.22 36.58,77.42 36.58,80.01 37.46,80.82 38.41,80.82 39.22,81.64 39.22,83.87 v39.12,83.97 | R5.2 60.28,87.46 PORT2.4 | R4.2 68.4,82.3 73.91,82.25 78.49,86.51 PORT1.4
  Top 0.762: C15.2 65.79,73.08 v65.46,72.75 | C6.2 67.51,73.33
  Top 1.016: PORT4.4 24.03,85.9 29.77,85.85 31.9,83.97 v39.12,83.97 | IC13.+VIN 16.26,32.49 v16.03,32.26 | IC14.+VIN 33.88,32.51 33.32,31.96 | IC15.+VIN 51.99,32.54 v51.59,32.13
  Top 1.143: v16.03,32.26 12.95,29.18 IC9.VIN+ | IC10.VIN+ 33.32,31.96 v33.45,31.98 | v51.59,32.13 48.64,29.18 IC11.VIN+
  Top 1.778: F1.2 4.6,56.54 v6.45,56.54
  Route2 1.016: PORT1.4 78.49,86.49 68.58,76.58 68.58,65.66 67.06,64.14 67.06,56.52 | PORT2.4 59.86,86.95 64.9,82.04 64.9,56.64 65.79,56.64 | PORT3.4 41.23,87.26 40.59,86.61 40.59,77.22 | 40.59,77.22 40.59,56.64 40.79,56.44 | v39.12,83.97 40.64,83.97 40.59,77.22
  Route2 1.778: v6.45,56.54 6.58,56.54
  pour Route2: 1.22,57.78 1.71,31.5 68.42,31.5 68.05,57.78
  pour Route2: 65.02,57.91 67.56,57.91 67.56,64.52 68.07,64.52 73.66,70.1 73.66,73.08 65.02,73.08
BNCIN1  (via drill 0.6)
  Top 0.762: IC6.7 68.83,38.61 v68.83,42.8 | v62.61,42.67 22.61,42.67 19.3,39.37 U$1.6
  Bottom 0.762: v68.83,42.8 62.61,42.8 v62.61,42.67
BNCIN2  (via drill 0.6)
  Top 0.762: IC6.6 70.48,39.88 v70.48,44.96 | v62.61,44.96 22.35,44.96 16.76,39.24 U$1.5
  Bottom 0.762: v70.48,44.96 v62.61,44.96
BNCOUT1  (via drill 0.6)
  Top 0.559: IC7.4 70.76,68.89 70.59,68.71
  Top 0.635: 70.59,68.71 66.17,64.29 66.17,56.97 70.36,52.78 70.36,46.84 v70.33,46.81
  Top 0.762: U$1.4 14.22,40.13 20.88,46.79 62.31,46.79 v62.33,46.81
  Bottom 0.762: v62.33,46.81 62.36,46.79 70.08,46.79 70.1,46.81 v70.33,46.81
BNCOUT2  (via drill 0.6)
  Top 0.559: IC7.3 70.54,70.16
  Top 0.635: 70.54,70.16 64.92,64.54 64.92,56.34 68.81,52.45 v68.81,48.39
  Top 0.762: U$1.3 11.68,41.02 19.31,48.31 62.31,48.31 v62.36,48.36
  Bottom 0.762: v68.81,48.39 68.78,48.36 v62.36,48.36
DRVR_ENBL  (via drill 0.6)
  Top 0.318: IC8.P$3 18.19,66.34 v19,65.53
  Top 0.635: v27.58,65.53 27.58,64.01 19.3,55.73 U$1.19/A5
  Route2 0.635: v19,65.53 v27.58,65.53
GND  (via drill 0.6, 0.7)
  Top 0.318: IC8.P$4 18.84,67.67 v19.15,67.11 19.49,67.7 IC8.P$5 | IC8.P$15 25.99,67.16 v26.01,67.06
  Top 0.508: v57.43,26.36 57.76,26.04 57.76,24.23 IC4.4 | IC5.4 77.29,25.22 v76.2,25.22
  Top 0.559: IC7.2 69.94,71.42 C6.1 | 67.28,70.26 C15.1 | IC7.5 71.12,67.61 v70.69,67.18
  Top 0.635: IC2.4 20.93,24.23 20.93,25.3 v20.3,25.93 | IC1.4 4.45,25.32 v3.68,26.09 | IC3.4 38.73,25.73 v38.28,26.19 | IC6.5 72.9,41.15 v72.14,41.91 | IC12.8 v54.1,81.53 | C12.1 57.15,74.42 v57.02,74.55 | IC13.-VIN 12.65,32.18
  Top 0.762: C5.2 v83.64,19.53 | C4.2 64.29,21.2 v64.29,19.56 | C3.2 45.03,20.6 v45.03,18.9 | C2.2 27.3,19.05 v27.28,19.02 | C1.2 10.79,20.04 v10.79,18.31 | C11.2 v71.75,32.26 | v66.36,68.45 66.36,68.94 67.3,69.88 67.3,70.3 67.28,70.3 C15.1 67.69,70.71 68.99,70.71 C6.1
  Top 1.016: v60.78,59.69 R1.1 | C13.2 12.62,66.27 v12.39,66.24 | 12.65,32.18 v10.41,32.18 | IC14.-VIN 28.75,32.51 v28.23,31.99 | IC15.-VIN 48.72,32.26 48.51,32.05 v45.21,32.05
  Top 1.143: IC9.VIN- v10.41,32.18 10.39,32.21 | IC10.VIN- 28.26,31 28.25,31.01 v28.23,31.99 | IC11.VIN- 45.21,29.84 v45.21,32.05
  Bottom 0.318: v19.15,67.11 19.18,67.11 19.2,67.08 | v26.01,67.06 26.06,67.11
  Bottom 0.508: v38.28,26.19 38.3,26.16
  Bottom 0.635: v71.75,32.26 72.01,32.26 72.14,32.13 | 70.46,62.97 70.31,63.12 v70.31,63.73
  Bottom 0.762: 64.26,19.2 64.29,19.23 v64.29,19.56 | v45.03,18.9 45.06,18.9
  Bottom 1.016: v60.78,59.69 60.73,59.69 60.68,59.64
  other vias: 72.54,62.48 71.02,62.43 69.52,62.43
  pour Route15: 1.27,57.15 1.27,31.47 45.97,31.34 45.97,57.02
  pour Bottom: 93.6,6.35 5.41,6.35 1.27,10.49 1.27,88.77 6.48,93.98 93.45,93.98 97.79,89.64 97.79,10.54
  pour Top: 73.56,64.44 68.91,64.44 68.91,60.73 73.53,60.73 73.56,60.76
GNDBB  (via drill 0.6, 1)
  Top 0.318: IC8.P$19 27.94,82.35 28.04,82.45
  Top 0.508: 28.04,82.45 v28.6,83.01
  Top 1.524: C14.CATHODE v3.25,82.3 | D1.A 3.23,76.68 v3.2,76.66
  Route15 0.508: v28.6,83.01 28.7,83.01 28.75,83.06
  Route15 1.524: v3.25,82.3 3.3,81.48 | v3.2,76.66 3.2,76.76 3.25,76.81
  pour Route15: 31.7,80.52 31.78,84.62 32.98,85.8 84.05,85.85 85.34,87.15 85.34,93.98 6.3,93.98 2.54,90.22 2.54,62.99 11.68,62.99 11.59,78.62 13.48,80.52
ISOGND  (via drill 0.55, 0.6)
  Top 0.508: C7.1 84.14,71.42
  Top 0.559: 84.14,71.42 IC7.15 | C18.2 81.76,58.93 v81.74,58.95 | C16.2 83.05,79.47 | 83.05,79.47 83.05,79.46 | v83.05,79.57 v83.05,79.56 83.05,79.47
  Top 0.762: C17.1 81.4,75.95 v81.4,77.57 v81.41,77.57 | C7.1 85.63,71.64 85.69,71.59 v85.71,71.61
  other vias: 81.69,62.41 83.74,63.78 83.19,62.46 84.61,62.48
  pour Route15: 80.63,50.07 80.74,79.57 85.72,84.55 97.68,84.61 97.86,49.85
  pour Top: 80.49,64.44 85.34,64.44 85.34,60.6 80.49,60.6
LED_BLUE  (via drill 0.6)
  Top 0.635: v59.92,56.26 54.89,56.26 53.34,57.81 53.34,61.67 53.37,61.7 51.69,63.37 U$8.P$3
  Bottom 0.635: U$1.33/A14 59.94,56.26 v59.92,56.26
LED_GREEN  (via drill 0.6)
  Top 0.635: U$1.2 9.14,40.77 18.26,49.89 61.19,49.89 v62.94,51.64 | v62.87,56.52 61.85,57.53 56.75,57.53 U$8.P$1
  Bottom 0.635: v62.87,56.52 62.94,56.44 v62.94,51.64
LED_RED
  Top 1.016: U$1.36/A17 52.32,56.75 U$8.P$4
N$1
  Top 0.635: IC3.8 42.55,18.03 42.77,17.8 44.93,17.8 46.26,16.48 R9.2 46.51,15.93 49.28,13.16 SERIAL4.4
N$2  (via drill 0.6)
  Top 0.635: IC3.7 41.27,17.73 43.23,15.77 43.3,15.77 R9.1 43.46,14.12 v43.48,14.1
  Bottom 0.635: SERIAL4.3 48.03,10.16 48.03,9.6 46.41,7.98 44.17,7.98 41.92,10.22 41.92,12.54 v43.48,14.1
N$3
  Top 0.635: IC3.6 40.01,16.38 43.18,12.7 SERIAL4.2
N$4
  Top 0.635: IC3.5 38.73,16.13 43.94,10.16 SERIAL4.1
N$5
  Top 0.635: IC3.2 41.3,24.23 41.3,36.98 U$1.25
N$6
  Top 0.635: U$1.24 40.01,37.47 IC3.3
N$7
  Top 0.635: IC1.8 8.26,17.98 8.74,17.5 9.6,17.5 10.62,16.48 R8.2 11.07,15.93 13.59,13.41 SERIAL5.4
N$8  (via drill 0.6)
  Top 0.635: IC1.7 6.99,16.76 R8.1 8.3,15.44 v8.3,14.2
  Bottom 0.635: SERIAL5.3 12.32,9.53 11.22,7.87 7.11,7.87 5.56,9.53 5.58,11.32 8.36,14.1 8.36,14.15 v8.3,14.2
N$9
  Top 0.635: IC1.6 5.71,15.14 8.15,12.7 SERIAL5.2
N$10
  Top 0.635: IC1.5 4.45,14.4 8.69,10.16 SERIAL5.1
N$11  (via drill 0.6)
  Top 0.635: IC1.2 6.99,35.43 v6.96,35.46
  Bottom 0.635: v6.96,35.46 5.64,35.46 4.06,37.03 U$1.0
N$12
  Top 0.635: IC1.3 5.71,36.96 U$1.1
N$13
  Top 0.635: IC6.3 85.22,39.88 87,38.1 90.17,38.1 92.2,40.13 92.2,42.42 91.19,43.43 U$4.GND
N$14
  Top 0.635: U$4.S 87.5,40.89 83.69,44.7 R3.2
N$15
  Top 0.635: U$3.S 88.24,22.86 86.23,24.87 86.23,30.73 83.31,33.66 R2.2
N$16
  Top 0.635: U$3.GND 89,30.89 81.28,38.61 IC6.2
N$17
  Top 0.635: IC2.8 24.77,17.96 24.92,17.8 26.87,17.8 28.25,16.43 R10.2 28.63,15.93 31.43,13.12 SERIAL3.4
N$18  (via drill 0.6)
  Top 0.635: IC2.7 23.5,17.52 25.09,15.93 R10.1 25.7,15.67 v25.7,14.13
  Bottom 0.635: SERIAL3.3 30.18,10.16 30.18,9.47 28.98,7.87 26.16,7.87 23.98,9.89 23.98,12.39 v25.7,14.12 v25.7,14.13
N$19
  Top 0.635: IC2.6 22.23,16.38 25.25,12.72 28.87,12.72 SERIAL3.2
N$20
  Top 0.635: PORT2.1 64.39,89.7 64.39,81.58 58.12,81.58 | 58.12,81.58 56.79,80.26 IC12.7 | R5.1 57.48,82.22 58.12,81.58
N$21
  Top 0.635: IC2.5 20.95,15.98 25.73,10.16 SERIAL3.1
N$22
  Top 0.635: IC2.2 23.5,35.31 21.84,36.96 U$1.7
N$23
  Top 1.016: L1.2 17.66,19.17 | 17.91,16.26 C8.2 18.47,16
  Top 1.143: SERIAL5.5 14.86,9.3 16.54,7.62 18.41,7.62 20.93,10.13 20.93,13.54 18.47,16 | L1.2 17.91,16.26
N$24
  Top 0.635: IC12.9 46.48,81.53 46.1,81.92 | 46.1,81.92 46.1,89.36 PORT3.1 | R6.2 43.28,81.92 46.1,81.92
N$25
  Top 1.016: U$8.P$2 55.95,63.42 58.04,63.42 58.95,62.51 R1.2
N$26
  Top 1.143: C8.1 15.36,14.48 16.13,13.72 SERIAL5.6 | C8.1 15.34,16.03 | 15.42,16.06 C8.1 | C8.1 15.47,16.11 15.47,27.03 15.49,27.05 IC9.VOUT- IC13.0V
N$27
  Top 0.559: IC7.13 84.96,68.89 86.64,67.21 86.64,58.95 | U$2.S 88.97,58.95 86.64,58.95 | 84.78,58.93 C18.1 86.67,58.93 86.64,58.95
N$28  (via drill 0.6)
  Top 0.635: IC2.3 22.23,33.73 v21.97,33.98
  Bottom 0.635: v21.97,33.98 21.97,35.28 U$1.8
N$29
  Top 1.524: U$1.VIN 1.52,56.26 F1.1
N$30
  Top 0.635: IC4.2 60.33,32.16 56.64,35.84 51.44,35.84 49.78,37.49 U$1.28
N$31
  Top 0.635: 28.57,90.42 28.5,90.42 | 28.5,90.42 PORT4.1 | IC12.11 40.59,78.99 | 40.59,78.99 40.59,85.5 33.43,85.5 28.5,90.42 | 40.59,78.99 38.99,78.99 R7.2
N$32
  Top 0.635: IC5.8 81.1,17.96 81.41,17.65 82.47,17.65 83.64,16.48 R12.2 84.96,14.63 SERIAL1.4
N$33  (via drill 0.6)
  Top 0.635: IC5.7 79.83,17 R12.1 80.44,15.52 80.44,14.35 v80.21,14.12
  Bottom 0.635: SERIAL1.3 83.69,8.26 83.06,7.62 79.05,7.62 77.8,8.87 77.8,11.71 v80.21,14.12
N$34
  Top 0.635: IC5.6 78.56,13.87 79.73,12.7 SERIAL1.2
N$35
  Top 0.635: IC5.5 77.29,12.95 80.09,10.16 SERIAL1.1
N$36
  Top 0.635: IC4.8 61.59,17.98 61.9,17.68 63.07,17.68 64.29,16.46 R11.2 67.12,13.1 SERIAL2.4
N$37  (via drill 0.6)
  Top 0.635: IC4.7 60.33,17.09 R11.1 61.9,15.52 v61.9,14.2
  Bottom 0.635: SERIAL2.3 64.41,7.75 61.72,7.75 59.94,9.53 59.94,12.24 v61.9,14.2
N$38
  Top 0.635: IC4.6 59.05,15.2 61.66,12.7 SERIAL2.2
N$39
  Top 1.143: 17.96,22.02 L1.1 18.03,22.08 IC9.VOUT+ IC13.+VOUT
N$40
  Top 0.635: IC4.5 57.78,14.66 62.41,10.03 63.25,10.03 SERIAL2.1
N$41
  Top 1.016: IC15.+VOUT 53.72,26.11 IC11.VOUT+
  Top 1.143: IC11.VOUT+ L3.1
N$42
  Top 0.635: IC5.2 79.83,26.54 78.44,27.81 68.86,27.81 67.31,29.36 67.31,51.56 63.75,55.12 58.8,55.12 57.4,53.72 U$1.34/A15
N$43
  Top 1.016: 33.64,12.96 SERIAL3.6 | IC14.0V 33.34,26.05 IC10.VOUT-
  Top 1.143: SERIAL3.6 33.4,13.45 C10.1 33.34,16.27 IC10.VOUT-
N$44
  Top 0.635: C10.2 36.25,16.2
  Top 1.016: L2.2 35.84,17.3 36.2,16.94 36.2,16.26
  Top 1.143: 36.2,16.26 36.25,16.2 38.86,13.59 38.86,9.78 36.83,7.75 34.49,7.75 32.68,9.56 SERIAL3.5
N$45
  Top 1.016: IC14.+VOUT 35.88,26.05 IC10.VOUT+
  Top 1.143: IC10.VOUT+ 35.84,28.84 L2.1
N$46  (via drill 0.6)
  Top 0.559: IC7.16 82.75,72.69 83.5,73.44 C7.2 | IC7.11 v83.72,66.34
  Top 0.635: v85.47,74.42 85.47,74.85 84.53,75.79 C17.2
  Top 0.762: C7.2 C17.2
  Bottom 0.635: v83.72,66.34 83.72,72.67 v85.47,74.42
N$47
  Top 1.016: 51.55,12.84 SERIAL4.6 | 50.8,16.38 C9.1 51.18,16.26 | IC15.0V 51.18,26.11 IC11.VOUT-
  Top 1.143: C9.1 51.05,13.97 SERIAL4.6 | IC11.VOUT- 51.18,16.76 50.8,16.38
N$48
  Top 0.635: IC5.3 78.56,25.58 77.72,26.42 68.43,26.42 65.25,29.59 65.25,51.16 63.48,52.93 62.33,52.93 60.5,51.1 56.57,51.1 54.86,52.81 U$1.35/A16
N$49
  Top 1.016: L3.2 53.35,19.3 | 53.72,16.26 C9.2 53.98,16.13
  Top 1.143: L3.2 53.72,16.26 | 53.98,16.13 56.52,13.59 56.52,9.91 54.38,7.77 52.3,7.77 50.55,9.53 SERIAL4.5
N$50
  Top 0.559: IC7.14 84.62,70.16 84.64,70.13 86.16,70.13 86.92,70.89 86.92,76 87.38,76.45 | 87.38,76.45 87.88,76.96 U$5.S | C16.1 85.7,78.13 87.38,76.45
N$51  (via drill 0.6)
  Top 0.635: IC4.3 59.05,31.47 55.93,34.59 52.35,34.59 v52.32,34.62
  Bottom 0.635: v52.32,34.62 U$1.29
N$54
  Top 0.635: IC6.1 79.76,37.34 79.88,37.21 79.88,33.78 R2.1
N$55
  Top 0.635: R3.1 79.63,41.46 IC6.4
N$56
  Top 0.635: IC12.5 68.28,77.72 | 68.28,77.72 73.33,77.72 83.95,87.63 83.95,88.77 PORT1.1 | R4.1 68.28,77.72
N$57
  cutout Route15: 18.03,89.41 18.03,88.39 19.56,88.39 19.56,89.41
N$58
  cutout Route15: 36.58,89.15 36.58,88.39 38.35,88.39 38.35,89.15
N$59
  cutout Route15: 55.37,88.9 55.37,88.39 56.64,88.39 56.9,88.39 56.9,88.9
N$60
  cutout Route15: 73.91,89.15 73.91,88.39 75.44,88.39 75.44,89.15
PORT1IN
  Top 0.635: U$1.39/A20 44.7,64.14 48.64,67.94 56.52,67.94 60.2,71.75 60.33,76.45 IC12.4
PORT1LED
  Top 0.635: U$1.37/A18 48.77,54.1 48.77,64.01 50.42,65.66 58.04,65.66 63.45,71.07 63.45,75.03 64.36,75.95 73.28,75.95 85.34,87.12 85.34,90.94 83.55,92.73 80.62,92.73 79.76,91.87 PORT1.3
PORT2IN  (via drill 0.6)
  Top 0.635: IC12.6 v61.98,78.99 | v61.98,76.2 61.85,71.37 57.28,66.8 49.4,66.8 46.61,64.01 46.61,53.72 U$1.38/A19
  Bottom 0.635: v61.98,78.99 v61.98,76.2
PORT2LED  (via drill 0.6)
  Top 0.635: U$1.14/A0 32,56.39 34.29,58.67 37.34,58.67 48.13,69.47 56.01,69.47 58.8,72.26 v58.8,73.41 | v58.8,80.14 66.17,80.14 66.17,91.57 65.3,92.18 61.67,92.18 61.09,91.69 61.09,90.47 PORT2.3
  Bottom 0.635: v58.8,73.41 v58.8,80.14
PORT3IN  (via drill 0.6)
  Top 0.635: IC12.10 v42.37,80.31 | v42.37,77.47 42.14,77.24 42.19,69.6 34.56,62.61 30.71,62.61 24.41,56.29 24.38,56.26 U$1.17/A3
  Bottom 0.635: v42.37,80.31 v42.37,77.47
PORT3LED  (via drill 0.6)
  Top 0.635: U$1.15/A1 29.46,56.06 33.27,59.87 36.52,59.87 45.16,68.5 v45.16,76.15
  Route2 0.635: v45.16,76.15 45.16,83.97 45.62,84.43 46.41,84.43 47.4,85.42 47.4,91.52 46.56,92.35 43.69,92.35 42.47,91.44 PORT3.3
PORT4IN
  Top 0.635: U$1.16/A2 26.92,56.67 31.42,61.16 35.97,61.16 43.59,68.78 43.59,76.89 44.42,77.72 IC12.12
PORT4LED  (via drill 0.6)
  Top 0.635: U$1.18/A4 21.84,56.16 30.4,64.72 v30.4,67.23
  Route2 0.635: PORT4.3 23.88,91.57 24.97,92.35 28.02,92.35 34.67,85.85 34.72,72.18 30.44,67.23 v30.4,67.23
VBB
  Top 1.524: IC8.VBB 17.1,75.1 10.57,82.3 C14.ANODE 9.64,77.22 D1.C 10.14,76.79 10.14,71.1 J5.PWR
VCC  (via drill 0.6, 0.8, 1)  (1 unrouted)
  Top 0.318: IC8.P$2 17.54,66.84 C13.1
  Top 0.635: IC3.1 42.55,25.35 44.09,25.35 44.78,24.66 44.78,23.75 C3.1 | IC4.1 61.59,25.43 63.25,25.43 63.93,24.74 63.93,24.23 64.14,24.08 C4.1 v65.94,24.08 | IC5.1 81.1,25.55 82.47,25.55 83.64,24.38 C5.1 83.68,23.61 v85.42,23.6 | 55.12,71.24 C12.2 54.86,72.01 54.36,72.01 53.72,72.64 IC12.1 | IC2.1 24.77,25.96 26.06,25.96 26.87,25.15 26.87,23.15 C2.1 | IC1.1 8.26,25.53 9.78,25.53 10.49,24.82 10.49,23.14 C1.1
  Top 0.762: C1.1 v12.62,22.86 | IC6.8 72.39,37.34 C11.1 70.23,36.71 69.47,35.94 v69.47,29.21
  Top 1.016: v29.36,23.52 C2.1 | C3.1 46.92,23.45 v46.94,23.47
  Top 1.27: v47.12,70.87 55.25,70.87 C12.2 | U$1.3.3V 6.6,53.75 v17.02,63.96 17.02,66.12 C13.1
  Top 1.524: U$1.3.3V3 37.08,38.94 39.24,40.66 60.69,40.66 62.23,38.98 v62.23,28.32
  Route2 0.635: v65.94,24.08 66.45,24.08 | v85.42,23.6 85.42,22.77 85.24,22.61
  Route2 0.762: v12.62,22.86 12.5,23.37 | v69.47,29.21 69.72,29.21
  Route2 1.016: v29.36,23.52 29.03,23.52 | v46.94,23.47 47.57,23.47
  Route2 1.27: v62.23,28.32 63.25,28.32 62.48,27.56 | v17.02,63.96 31.93,63.91 v38.68,70.36
  Bottom 1.27: v38.68,70.36 46.61,70.36 v47.12,70.87
  pour Route2: 1.41,30.4 1.27,20.32 86.33,20.44 86.33,30.28
VLV1IN
  Top 0.318: IC8.P$6 20.14,67.69 20.47,67.31 | IC8.P$7 20.79,67.68 20.47,67.46
  Top 0.635: U$1.23/A9 9.09,53.09 20.47,64.21 20.47,67.31 20.47,67.46
VLV1OUT
  Top 0.318: IC8.P$33 18.84,82.4 18.64,82.65 18.09,82.5 18.19,82.35 18.14,82.35 | 18.14,82.35 17.98,82.5 17.73,82.5 17.58,82.35 17.42,82.45 | 17.42,82.45 17.22,82.5 17.07,82.5 16.89,82.32 IC8.P$36 | IC8.P$35 17.54,82.28 17.42,82.45 | IC8.P$34 18.19,82.29 18.14,82.35
  Top 0.635: 16.82,82.65 18.64,82.65
  Top 0.762: 16.82,82.65 15.64,82.64 12.12,86.16 12.12,91.71 14.45,94.13 65.94,94.13 69.6,90.32 69.6,87.38 71.68,85.29 74.22,85.29 75.95,86.82 PORT1.6
VLV2IN
  Top 0.318: IC8.P$8 21.44,67.72 21.79,67.51 22.09,67.76 IC8.P$9
  Top 0.635: U$1.22/A8 11.68,53.65 21.79,63.7 21.79,67.51
VLV2OUT
  Top 0.318: IC8.P$29 21.44,82.45 21.39,82.5 20.88,82.5 | 20.88,82.5 20.78,82.4 | 20.78,82.4 20.68,82.4 20.57,82.5 | 20.57,82.5 20.47,82.5 | 20.47,82.5 20.27,82.5 | 20.27,82.5 20.17,82.4 | 20.17,82.4 20.02,82.4 19.91,82.5 19.51,82.5 19.51,81.72 IC8.P$32 | IC8.P$31 20.14,82.37 20.17,82.4 | IC8.P$30 20.79,82.39 20.78,82.4 | 20.88,82.5 20.57,82.5 | 20.27,82.5 19.56,82.5 | 20.42,82.75 20.42,82.55 20.47,82.5
  Top 0.762: 20.42,82.75 20.42,83.3 18.54,84.3 15.9,84.3 13.54,86.67 13.54,90.46 15.59,92.61 48.77,92.61 50.85,90.37 50.85,87.38 53.03,85.19 56.19,85.19 57.45,86.46 57.45,87.75
  Top 1.016: 57.45,87.75 PORT2.6
VLV3IN
  Top 0.318: IC8.P$12 24.04,67.76 24.33,67.56 24.69,67.77 IC8.P$13
  Top 0.635: U$1.20/A6 16.76,54.86 24.38,62.48 24.33,67.56
VLV3OUT  (via drill 0.6)
  Top 0.318: IC8.P$24 24.69,82.4 24.74,82.45 25.3,82.45 25.35,82.4 25.35,81.66 IC8.P$23 25.34,82.39 25.4,82.45 25.65,82.45 | 25.65,82.45 25.96,82.45 26.01,82.4 26.01,81.67 IC8.P$22 25.99,82.43 26.01,82.45 26.57,82.45 26.62,82.4 26.62,81.67 IC8.P$21 26.64,82.43 26.62,82.45 | 25.7,82.65 25.7,82.5 25.65,82.45
  Top 0.762: 25.7,82.65 25.7,82.96 27.79,84.53 29.11,84.53 31.29,82.35 v37.03,82.35
  Bottom 0.762: v37.03,82.35 37.03,85.65 38.71,86.92 38.71,87.87
  Bottom 1.016: 38.71,87.87 PORT3.6
VLV4IN
  Top 0.318: IC8.P$10 22.74,67.84 23.06,67.56 23.39,67.84 IC8.P$11
  Top 0.635: U$1.21/A7 14.33,54.3 23.06,63.04 23.06,67.56
VLV4OUT
  Top 0.318: IC8.P$25 24.04,82.44 23.93,82.55 23.16,82.55 | 23.52,82.55 23.42,82.45 | 23.42,82.45 23.27,82.45 23.16,82.55 | 23.16,82.55 23.01,82.55 | 23.01,82.55 22.91,82.55 | 22.91,82.55 22.76,82.4 22.71,82.4 | 22.71,82.4 22.55,82.55 | 22.55,82.55 22.25,82.55 22.1,82.45 22.1,81.66 IC8.P$28 | IC8.P$27 22.74,82.36 22.71,82.4 | IC8.P$26 23.39,82.42 23.42,82.45 | 22.91,82.55 22.55,82.55 | 23.01,82.8 23.01,82.55
  Top 0.762: 23.01,82.8 22.96,84.23 20.07,86.31 PORT4.6

### Text on the board
tPlace: 10uf | + | + | IC8 | . | Pos. Ctr | 12-24VDC | Teensy 4.1 | Bpod FSM r2.5 | / | / | / | r2.5 PCB v6